# Altium schematic sheet SuperFin Baseboard pg6.SchDoc
size B; PageSetup: Record=PageOptions|CenterHorizontal=True|CenterVertical=True|PrintScale=1.09|XCorrection=1.00|YCorrection=1.00|PrintKind=0|BorderSize=5000000|LeftOffset=0|BottomOffset=0|Orientation=2|PaperLength=1000|PaperWidth=1000|Scale=100|PaperSource=7|PrintQuality=-4|MediaType=1|DitherType=10|PaperKind=Tabloid 11 x 17in|PrintScaleMode=1
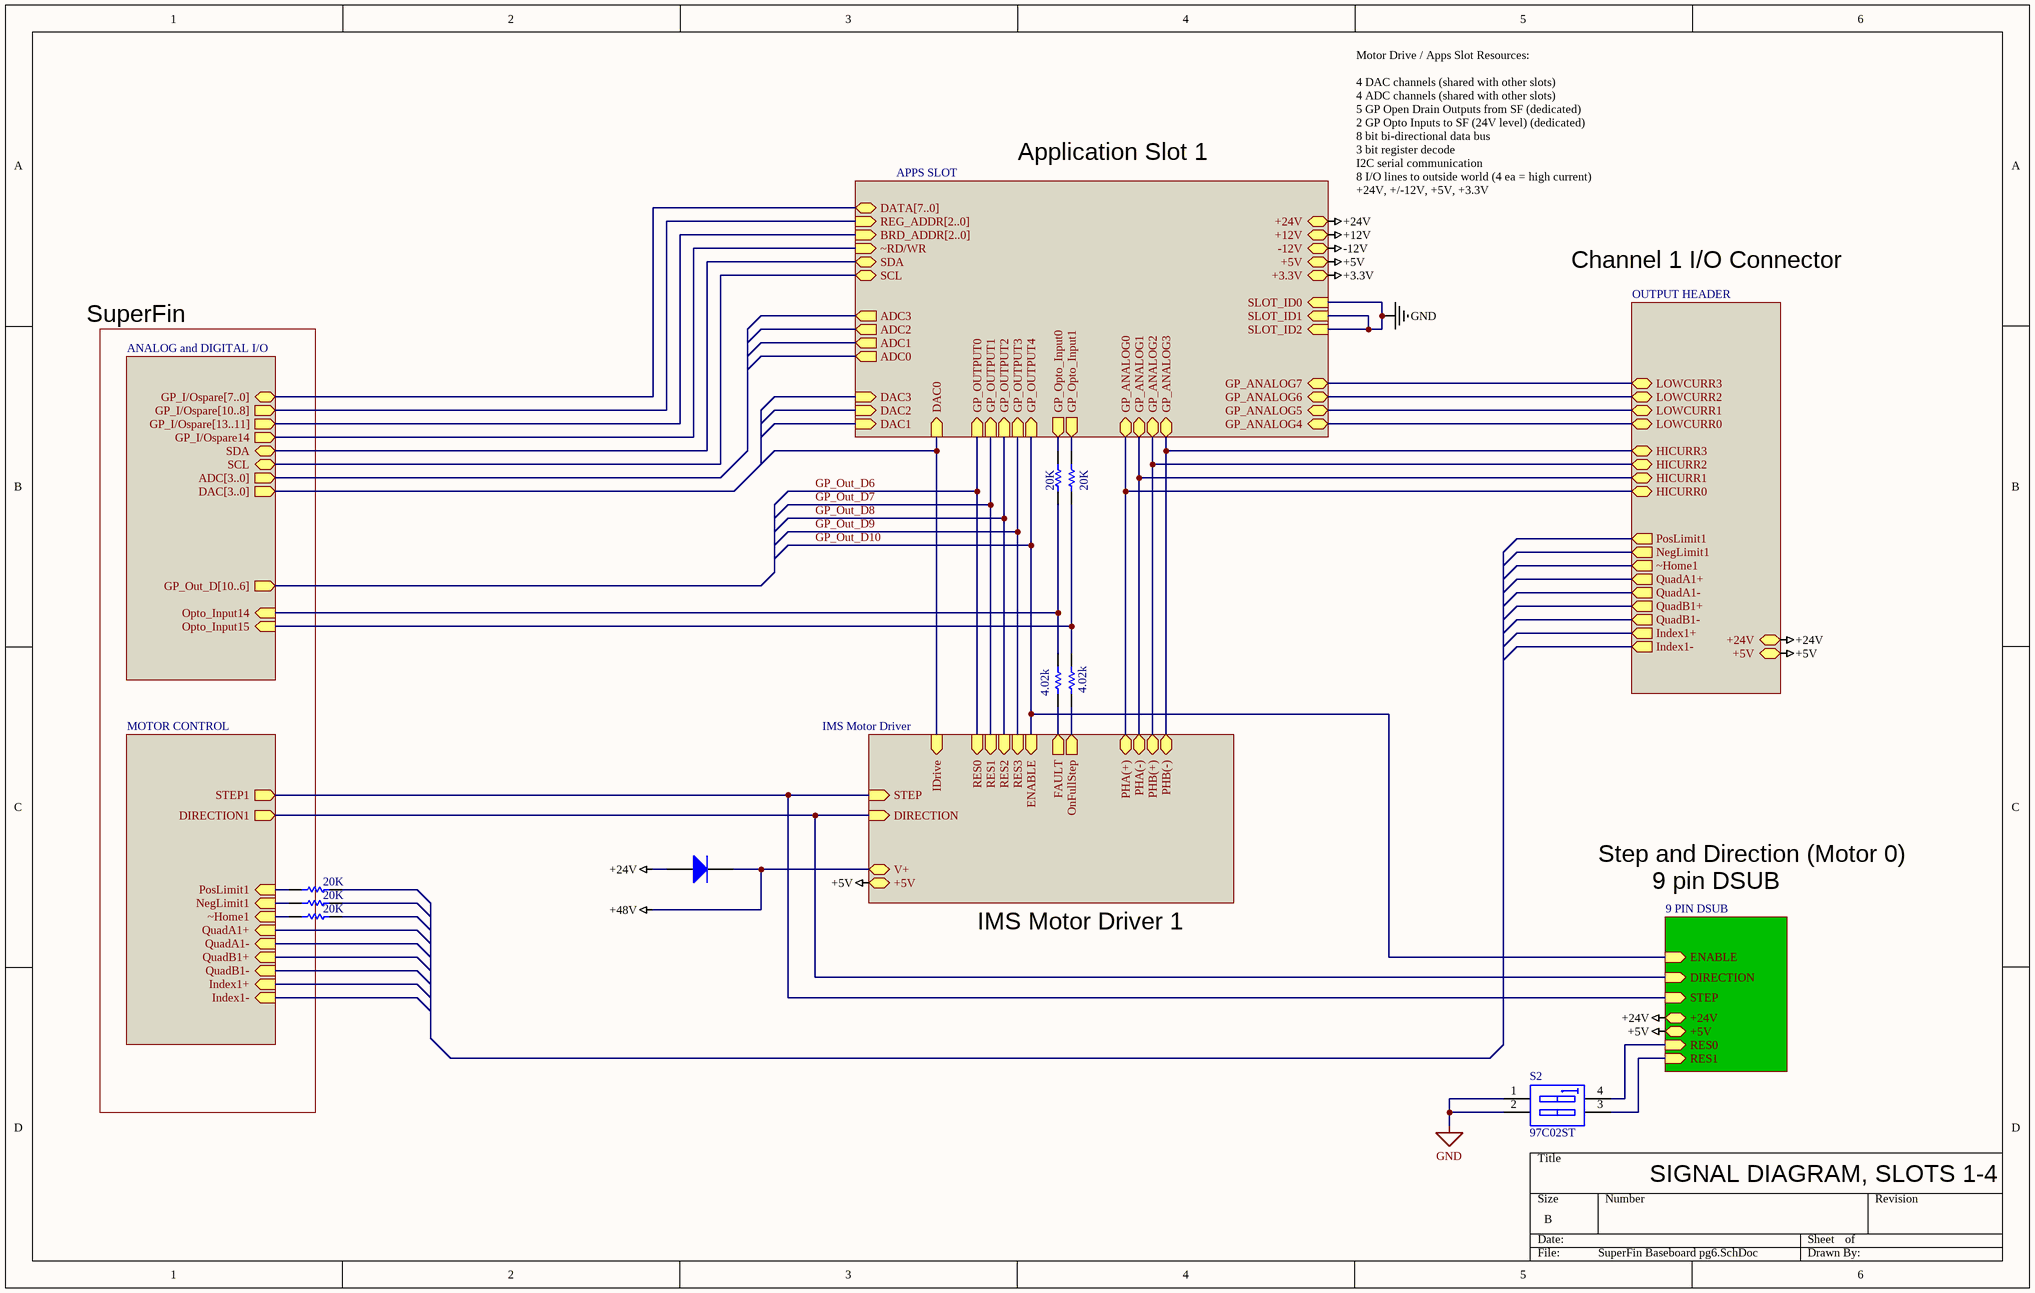
[diagram p0: SuperFin Baseboard pg6.SchDoc]

## Parts
D1  Diode 1N4001  [DIO10.46-5.3x2.8]  (value not drawn)
R10  value 20K  [SMD_0805]  (hidden comment: Res 0805)
R11  value 20K  [SMD_0805]  (hidden comment: Res 0805)
R12  value 4.02k  [SMD_0805]  (hidden comment: Res 0805)
R13  value 4.02k  [SMD_0805]  (hidden comment: Res 0805)
R14  value 20K  [SMD_0805]  (hidden comment: Res 0805)
R15  value 20K  [SMD_0805]  (hidden comment: Res 0805)
R16  value 20K  [SMD_0805]  (hidden comment: Res 0805)
S2  97C02ST  [97C02ST]

## Sub-sheets
? = ANALOG and DIGITAL I/O: GP_Out_D[10..6] (out), DAC[3..0] (out), Opto_Input14 (in), Opto_Input15 (in), ADC[3..0] (out), GP_I/Ospare[7..0] (bidir), GP_I/Ospare[10..8] (out), GP_I/Ospare[13..11] (out), SDA (bidir), SCL (bidir), GP_I/Ospare14 (out)
? = MOTOR CONTROL: STEP1 (out), DIRECTION1 (out), PosLimit1 (in), NegLimit1 (in), ~Home1 (in), QuadA1+ (in), QuadA1- (in), QuadB1+ (in), QuadB1- (in), Index1+ (in), Index1- (in)
? = APPS SLOT: GP_ANALOG0 (bidir), GP_ANALOG1 (bidir), GP_ANALOG2 (bidir), GP_ANALOG3 (bidir), GP_ANALOG4 (bidir), GP_ANALOG5 (bidir), GP_ANALOG6 (bidir), GP_ANALOG7 (bidir), DAC0 (in), DAC1 (in), DAC2 (in), DAC3 (in), GP_Opto_Input0 (out), ADC0 (out), ADC1 (out), ADC2 (out), ADC3 (out), DATA[7..0] (bidir), REG_ADDR[2..0] (in), BRD_ADDR[2..0] (in), +5V (bidir), +24V (bidir), +12V (bidir), -12V (bidir), +3.3V (bidir), GP_OUTPUT0 (in), GP_OUTPUT1 (in), GP_OUTPUT2 (in), GP_OUTPUT3 (in), GP_OUTPUT4 (in), GP_Opto_Input1 (out), SLOT_ID0 (in), SLOT_ID1 (in), SLOT_ID2 (in), SDA (bidir), SCL (bidir), ~RD/WR (in)
? = IMS Motor Driver: RES0 (in), RES1 (in), RES2 (in), RES3 (in), ENABLE (in), PHA(+) (bidir), PHA(-) (bidir), PHB(+) (bidir), PHB(-) (bidir), IDrive (in), FAULT (out), OnFullStep (out), STEP (in), DIRECTION (in), V+ (bidir), +5V (bidir)
? = OUTPUT HEADER: LOWCURR0 (bidir), LOWCURR1 (bidir), LOWCURR2 (bidir), LOWCURR3 (bidir), HICURR0 (bidir), HICURR1 (bidir), HICURR2 (bidir), HICURR3 (bidir), PosLimit1 (out), NegLimit1 (out), ~Home1 (out), QuadA1+ (out), QuadA1- (out), QuadB1+ (out), QuadB1- (out), Index1+ (out), Index1- (out), +24V (bidir), +5V (bidir)
? = 9 PIN DSUB: STEP (in), DIRECTION (in), ENABLE (in), +24V (bidir), +5V (bidir), RES0 (in), RES1 (in)

## Nets
+3.3V: sheet /+3.3V
+5V: sheet /+5V, sheet /+5V, sheet /+5V, sheet /+5V
+12V: sheet /+12V
+24V: D1.1(A) ; sheet /+24V, sheet /+24V, sheet /+24V
+48V: D1.2(K) ; sheet /V+
-12V: sheet /-12V
GND: S2.1(A1) S2.2(A2) ; sheet /SLOT_ID0, sheet /SLOT_ID1, sheet /SLOT_ID2
GP_Out_D6: sheet /GP_OUTPUT0, sheet /RES0
GP_Out_D7: sheet /GP_OUTPUT1, sheet /RES1
GP_Out_D8: sheet /GP_OUTPUT2, sheet /RES2
GP_Out_D9: sheet /GP_OUTPUT3, sheet /RES3
GP_Out_D10: sheet /GP_OUTPUT4, sheet /ENABLE, sheet /ENABLE
NetR10_1: R10.1 R12.2 ; sheet /Opto_Input14
NetR10_2: R10.2 ; sheet /GP_Opto_Input0
NetR11_1: R11.1 ; sheet /GP_Opto_Input1
NetR11_2: R11.2 R13.2 ; sheet /Opto_Input15
NetR12_1: R12.1 ; sheet /FAULT
NetR13_1: R13.1 ; sheet /OnFullStep
NetR14_1: R14.1 ; sheet /PosLimit1
NetR15_1: R15.1 ; sheet /NegLimit1
NetR16_1: R16.1 ; sheet /~Home1
NetS2_3: S2.3(B2) ; sheet /RES1
NetS2_4: S2.4(B1) ; sheet /RES0
(unnamed): sheet /SDA, sheet /SDA
(unnamed): sheet /SCL, sheet /SCL
(unnamed): sheet /GP_I/Ospare14, sheet /~RD/WR
(unnamed): sheet /STEP1, sheet /STEP, sheet /STEP
(unnamed): sheet /DIRECTION1, sheet /DIRECTION, sheet /DIRECTION
(unnamed): sheet /GP_ANALOG0, sheet /PHA(+), sheet /HICURR0
(unnamed): sheet /GP_ANALOG1, sheet /PHA(-), sheet /HICURR1
(unnamed): sheet /GP_ANALOG2, sheet /PHB(+), sheet /HICURR2
(unnamed): sheet /GP_ANALOG3, sheet /PHB(-), sheet /HICURR3
(unnamed): sheet /GP_ANALOG4, sheet /LOWCURR0
(unnamed): sheet /GP_ANALOG5, sheet /LOWCURR1
(unnamed): sheet /GP_ANALOG6, sheet /LOWCURR2
(unnamed): sheet /GP_ANALOG7, sheet /LOWCURR3
(unnamed): sheet /DAC0, sheet /IDrive

Not connected (* = marked no-connect by the designer): R14 2; R15 2; R16 2

## Buses and harness runs
bus sheet /BRD_ADDR[2..0] = sheet /GP_I/Ospare[13..11]
bus sheet /DATA[7..0] = sheet /GP_I/Ospare[7..0]
bus sheet /GP_I/Ospare[10..8] = sheet /REG_ADDR[2..0]

## Notes on the sheet
- Application Slot 1
- Motor Drive / Apps Slot Resources:
  4 DAC channels (shared with other slots)
  4 ADC channels (shared with other slots)
  5 GP Open Drain Outputs from SF (dedicated)
  2 GP Opto Inputs to SF (24V level) (dedicated)
  8 bit bi-directional data bus
  3 bit register decode
  I2C serial communication
  8 I/O lines to outside world (4 ea = high current)
  +24V, +/-12V, +5V, +3.3V
- Channel 1 I/O Connector
- SuperFin
- Step and Direction (Motor 0)
- 9 pin DSUB
- IMS Motor Driver 1
- SIGNAL DIAGRAM, SLOTS 1-4

## Library data of the parts
D1 = Diode 1N4001: 1 Amp General Purpose Rectifier; Published: 8-Jun-2000; LatestRevisionDate: 17-Jul-2002; LatestRevisionNote: Re-released for DXP Platform.; DatasheetVersion: 1998; PackageVersion: Aug-1999; PackageReference: DO-41; Publisher: Altium Limited; Code_JEDEC: DO-204-AL; ComponentLink1Description: Manufacturer Link; ComponentLink1URL: http://www.fairchildsemi.com/; ComponentLink2Description: Datasheet; ComponentLink2URL: http://www.fairchildsemi.com/ds/1N%2F1N4001.pdf
R10 R11 R14-R16 = Res SMD: Resistor 0805; Manufacturer: Vishay/Dale; Manuf p/n: CRCW080520KFKEA; Vendor: DIGIKEY; Vendor p/n: 541-20KCCT-ND; Vendor Mult.: 10; COST: 0.09
R12 R13 = Res SMD: Resistor 0805; Manufacturer: Vishay/Dale; Manuf p/n: CRCW08054.02kFKEA; Vendor: DIGIKEY; Vendor p/n: 541-4.02kCCT-ND; Vendor Mult.: 10; COST: 0.09
S2 = SW DIP-2: DIP Switch, 2 Position, SPST; Manufacturer: Grayhill; Vendor: DIGIKEY; Vendor Mult.: 1; Vendor p/n: GH1370-ND; LCO p/n: 185-00008; COST: 1.97; Manuf p/n: 97C02ST; Value: SW DIP-2